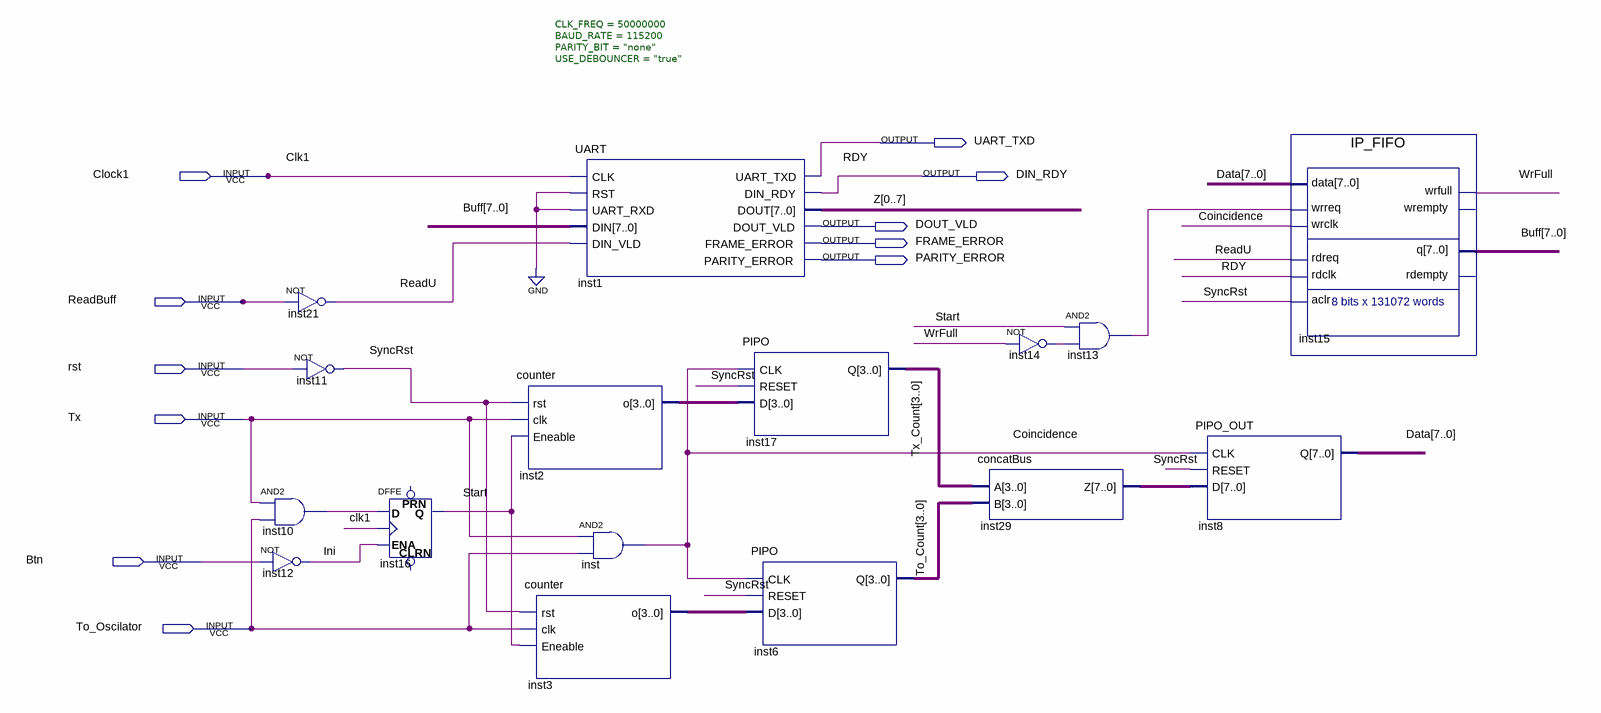
[diagram p0: schematic sheet]
// Quartus schematic Basic_FQ.bdf as structural Verilog: 16 symbols, 11 pins
module Basic_FQ (
  input  Clock1,
  input  ReadBuff,
  input  rst,
  input  Tx,
  input  Btn,
  input  To_Oscilator,
  output UART_TXD,
  output DIN_RDY,
  output DOUT_VLD,
  output FRAME_ERROR,
  output PARITY_ERROR
);

  wire Coincidence, Ini, inst10_out, inst13_out, inst14_out, ReadU, Start, SyncRst, WrFull;
  wire [3:0] inst2_o, inst3_o, To_Count, Tx_Count;
  wire [7:0] Buff, Data, inst29_z, Z;

  and inst10 (inst10_out, Tx, To_Oscilator);
  not inst12 (Ini, Btn);
  not inst21 (ReadU, ReadBuff);
  not inst11 (SyncRst, rst);
  DFFE inst16 (.D(inst10_out), .CLK(Clock1), .ENA(Ini), .Q(Start));  // open: PRN, CLRN
  counter inst2 (.rst(SyncRst), .clk(Tx), .Eneable(Start), .o(inst2_o));
  counter inst3 (.rst(SyncRst), .clk(To_Oscilator), .Eneable(Start), .o(inst3_o));
  UART #(.CLK_FREQ(50000000), .BAUD_RATE(115200), .PARITY_BIT("none"), .USE_DEBOUNCER("true")) inst1 (
    .CLK(Clock1), .RST(1'b0), .UART_RXD(1'b0), .DIN(Buff), .DIN_VLD(ReadU), .UART_TXD(UART_TXD),
    .DIN_RDY(DIN_RDY), .DOUT({Z[0], Z[1], Z[2], Z[3], Z[4], Z[5], Z[6], Z[7]}), .DOUT_VLD(DOUT_VLD),
    .FRAME_ERROR(FRAME_ERROR), .PARITY_ERROR(PARITY_ERROR));
  and inst (Coincidence, Tx, To_Oscilator);
  PIPO inst17 (.CLK(Coincidence), .RESET(SyncRst), .D(inst2_o), .Q(Tx_Count));
  PIPO inst6 (.CLK(Coincidence), .RESET(SyncRst), .D(inst3_o), .Q(To_Count));
  concatBus inst29 (.A(Tx_Count), .B(To_Count), .Z(inst29_z));
  and inst13 (inst13_out, Start, inst14_out);
  not inst14 (inst14_out, WrFull);
  PIPO_OUT inst8 (.CLK(Coincidence), .RESET(SyncRst), .D(inst29_z), .Q(Data));
  IP_FIFO inst15 (
    .data(Data), .wrreq(inst13_out), .wrclk(Coincidence), .rdreq(ReadU), .rdclk(DIN_RDY), .aclr(SyncRst),
    .wrfull(WrFull), .q(Buff));  // open: wrempty, rdempty

  // Other names for the same wires on the sheet: clk1 = Clock1; RDY = DIN_RDY
endmodule
